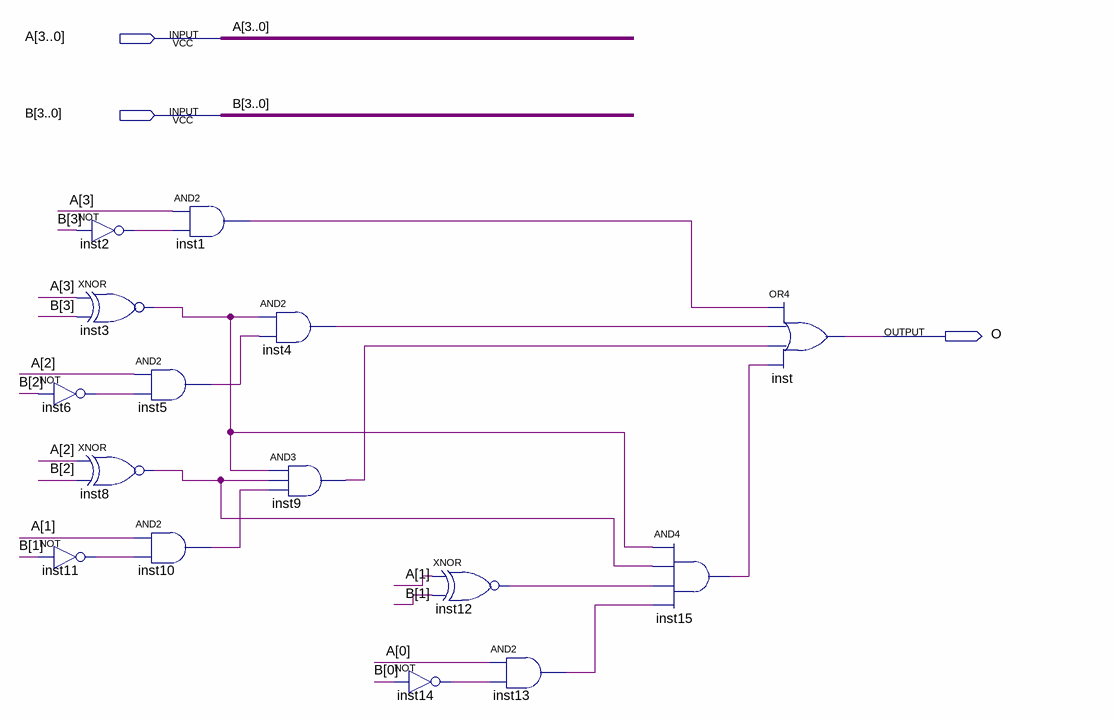
[diagram p0: schematic sheet]
// Quartus schematic comp_mag.bdf as structural Verilog: 15 symbols, 3 pins
module comp_mag (
  input  [3:0] A,
  input  [3:0] B,
  output O
);

  wire inst1_out, inst2_out, inst3_out, inst4_out, inst5_out, inst6_out, inst8_out, inst9_out, inst10_out,
       inst11_out, inst12_out, inst13_out, inst14_out, inst15_out;

  not inst6 (inst6_out, B[2]);
  not inst11 (inst11_out, B[1]);
  not inst2 (inst2_out, B[3]);
  xnor inst3 (inst3_out, A[3], B[3]);
  xnor inst8 (inst8_out, A[2], B[2]);
  and inst1 (inst1_out, A[3], inst2_out);
  and inst5 (inst5_out, A[2], inst6_out);
  and inst10 (inst10_out, A[1], inst11_out);
  and inst4 (inst4_out, inst3_out, inst5_out);
  and inst9 (inst9_out, inst3_out, inst8_out, inst10_out);
  xnor inst12 (inst12_out, A[1], B[1]);
  not inst14 (inst14_out, B[0]);
  and inst13 (inst13_out, A[0], inst14_out);
  and inst15 (inst15_out, inst3_out, inst8_out, inst12_out, inst13_out);
  or inst (O, inst1_out, inst4_out, inst9_out, inst15_out);
endmodule
